# EAGLE design Brueckenverstaerker v3 (7.X) (EAGLE 7.7.0)
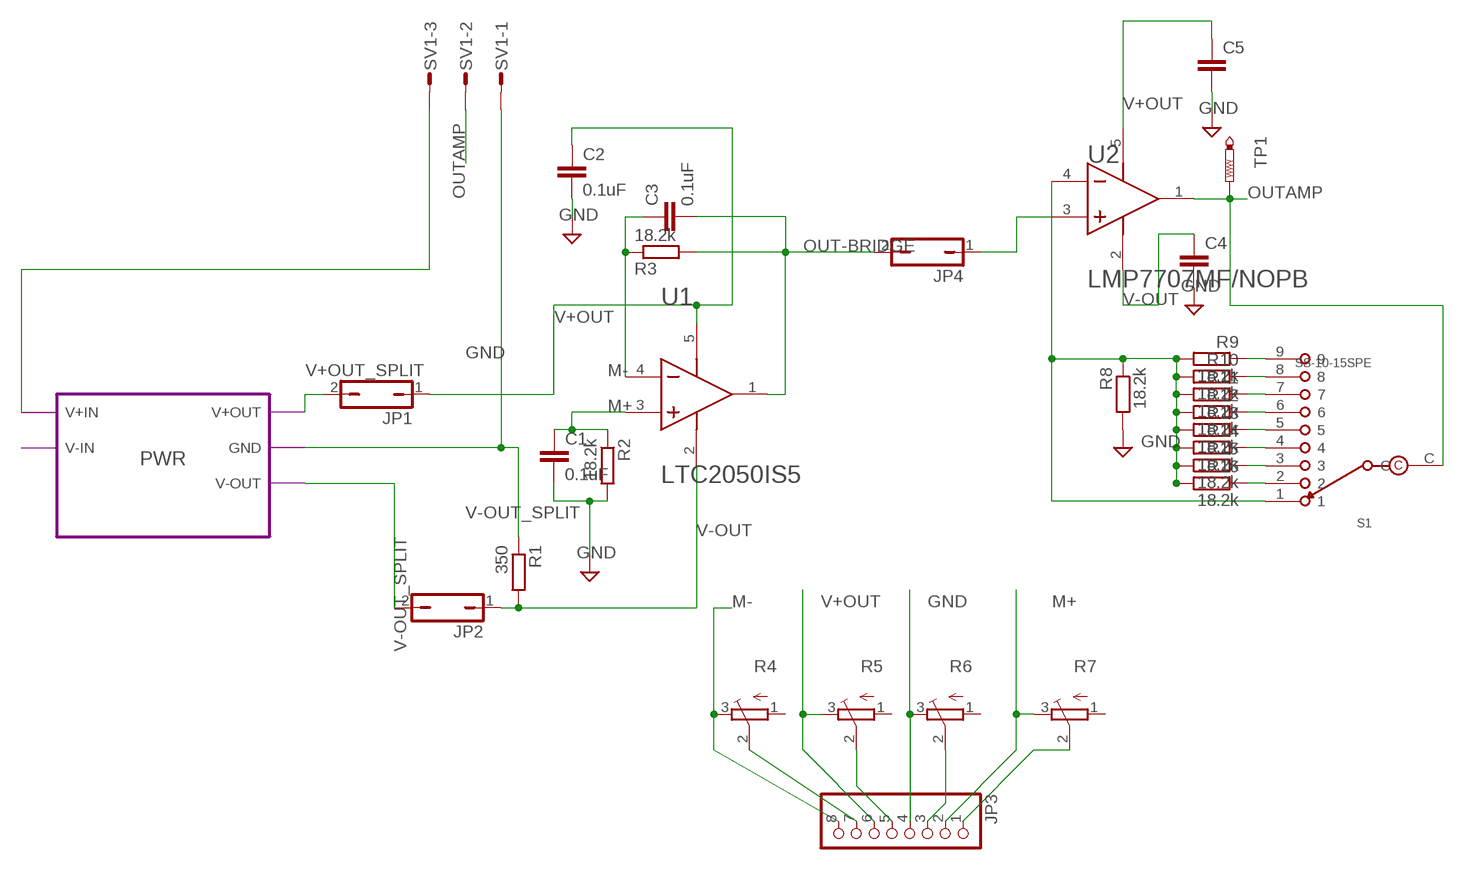
[diagram p0: schematic, sheet 1]

## Parts
C1  0.1uF  C-EUC0805  [C0805]
C2  0.1uF  C-EUC0805  [C0805]
C3  0.1uF  C-EUC0805  [C0805]
C4  C-EUC0805  [C0805]
C5  C-EUC0805  [C0805]
JP1  JP1Q  [JP1]
JP2  JP1Q  [JP1]
JP3  PINHD-1X8/90  [1X08/90]
JP4  JP1Q  [JP1]
R1  350  R-EU_R0805  [R0805]
R2  18.2k  R-EU_R0805  [R0805]
R3  18.2k  R-EU_R0805  [R0805]
R4  TRIM_EU-3223J  [3223J]
R5  TRIM_EU-3223J  [3223J]
R6  TRIM_EU-3223J  [3223J]
R7  TRIM_EU-3223J  [3223J]
R8  18.2k  R-EU_R0603  [R0603]
R9  18.2k  R-EU_R0603  [R0603]
R10  18.2k  R-EU_R0603  [R0603]
R11  18.2k  R-EU_R0603  [R0603]
R12  18.2k  R-EU_R0603  [R0603]
R13  18.2k  R-EU_R0603  [R0603]
R14  18.2k  R-EU_R0603  [R0603]
R15  18.2k  R-EU_R0603  [R0603]
R16  18.2k  R-EU_R0603  [R0603]
S1  SS-10-15SPE  [SW_SS-10-15SPE]
SV1  L03P  [L03P]
TP1  PTR1B1,27  [B1,27]
U1  LINEAR_TECHNOLOGY_LTC2050IS5LINEAR_TECHNOLOGY_LTC2050IS5_0_0  [LINEAR_TECHNOLOGY_LTC2050IS5_0]
U2  TI_NATIONAL_SEMICONDUCTOR_LMP7707MF-NOPBTI_NATIONAL_SEMICONDUCTOR_LMP7707MF-NOPB_0_1  [TI_NATIONAL_SEMICONDUCTOR_LMP7707MF-NOPB_1]

## Module instances
PWR = POWERSUPPLY

## Nets
GND: C1.2 C2.2 C4.2 C5.2 JP3.4 R1.1 R2.2 R6.3(E) R8.2 SV1.1 ; port PWR.GND
M+: C1.1 JP3.2 R2.1 R7.3(E) U1.3(+IN)
M-: C3.1 JP3.8 R3.1 R4.3(E) U1.4(-IN)
N$1: JP3.7 R4.2(S)
N$2: R9.1 S1.9
N$3: R8.1 R9.2 R10.2 R11.2 R12.2 R13.2 R14.2 R15.2 R16.2 S1.1 U2.4(IN-)
N$4: JP3.5 R5.2(S)
N$5: R10.1 S1.8
N$6: JP3.3 R6.2(S)
N$7: R11.1 S1.7
N$8: JP3.1 R7.2(S)
N$9: JP4.1 U2.3(IN+)
N$11: R12.1 S1.6
N$12: R13.1 S1.5
N$13: R14.1 S1.4
N$14: R15.1 S1.3
N$15: R16.1 S1.2
OUT-BRIDGE: C3.2 JP4.2 R3.2 U1.1(OUT)
OUTAMP: S1.C SV1.2 TP1.TP U2.1(OUT)
V+IN: SV1.3 ; port PWR.V+IN
V+OUT: C2.1 C5.1 JP1.1 JP3.6 R5.3(E) U1.5(V+) U2.5(V+)
V+OUT_SPLIT: JP1.2 ; port PWR.V+OUT
V-OUT: C4.1 JP2.1 R1.2 U1.2(V-) U2.2(V-)
V-OUT_SPLIT: JP2.2 ; port PWR.V-OUT
Unconnected: R4.1(A) R5.1(A) R6.1(A) R7.1(A)

## Library data of the parts
C1-C5 = rcl:C-EU: CAPACITOR, European symbol
JP1 JP2 JP4 = jumper:JP1Q: JUMPER
JP3 = pinhead:PINHD-1X8: PIN HEADER
R1-R3 R8-R16 = rcl:R-EU_: RESISTOR, European symbol
R4-R7 = pot:TRIM_EU-: POTENTIOMETER
S1 = SS-10-15SPE:SS-10-15SPE: Switch Rotary SP Screwdriver PC Pins 0.1A 5VDC Plastic Bag; AVAILABILITY: Unavailable; DESCRIPTION: Switch Rotary SP Screwdriver PC Pins 0.1A 5VDC Plastic Bag; MF: Nidec Copal; MP: SS-10-15SPE; PACKAGE: None; PRICE: None
SV1 = con-amp-mt:L03P: AMP MT CONNECTOR; OC_FARNELL: unknown; OC_NEWARK: unknown
TP1 = testpad:PTR1: TEST PIN
U1 = Linear Technology - LTC2050IS5:LINEAR_TECHNOLOGY_LTC2050IS5: LT-LT1395-LT18XX-LTC20XX-5; CHANNELS_: 1; CIIVA_IDS: 8827709; CODE__JEDEC: MO-193; COMPONENT_LINK_1_DESCRIPTION: Manufacturer URL; COMPONENT_LINK_1_URL: http://www.linear.com/; COMPONENT_LINK_3_DESCRIPTION: Package Specification; COMPONENT_LINK_3_URL: http://cds.linear.com/docs/en/packaging/SOT_5_05-08-1635.pdf; DATASHEET: http://cds.linear.com/docs/en/datasheet/2050fc.pdf; DATASHEET_VERSION: Rev C; FOOTPRINT_VARIANT_NAME_0: Level C; FOOTPRINT_VARIANT_NAME_1: Level B; FOOTPRINT_VARIANT_NAME_2: Level A; GBW_MHZ_TYPICAL: 3; IMPORTED: yes; IMPORTED_FROM: vault; IMPORT_TS: 1521848410; IS_MA_TYPICAL: 0.8; LINEAR_TECHNOLOGY_PART_NUMBER: LTC2050; MF: Linear Technology; MOUNTING_TECHNOLOGY: Surface Mount; MPN: LTC2050IS5; PACKAGE: LT-S5-5-TSOT-23; PACKAGE_DESCRIPTION: 5-Lead Plastic TSOT-23, Body 1.63 x 2.90 mm, Pitch 0.95 mm; PREFIX: U; RELEASE_DATE: 1378745203; SR_VUS_TYPICAL: 2; TYPE: ZD; VAULT_GUID: 8555B049-ED4F-4380-B7FA-2379FF4543B7; VAULT_REVISION: DA8BFDE5-EBAF-4C16-8E03-9404D310B1D4; VOS_MV_TYPICAL: 0.0005; VS_MAX_V: 6; VS_MIN_V: 2.7
U2 = NOPB:TI_NATIONAL_SEMICONDUCTOR_LMP7707MF-NOPB: AMP-OPA-LM7121-5; CIIVA_IDS: 1322878; COMPONENT_LINK_1_DESCRIPTION: Datasheet URL; COMPONENT_LINK_1_URL: http://www.ti.com/general/docs/lit/getliterature.tsp?genericPartNumber=LMP7707&fileType=pdf; COMP_TYPE: Amplifiers; FOOTPRINT_VARIANT_NAME_0: Level C; FOOTPRINT_VARIANT_NAME_1: Level B; FOOTPRINT_VARIANT_NAME_2: Level A; IMPORTED: yes; IMPORTED_FROM: vault; IMPORT_TS: 1521865583; MF: TI National Semiconductor; MPN: LMP7707MF/NOPB; PACKAGE_DESCRIPTION: Molded SOT-23, .115 x .063 x .040 in Body, 5 Lead, .0375 in Pitch; PACKAGE_REFERENCE: DBV0005A; PACKAGE_TOP_MARKING: AH4A*XTT; PIN_COUNT: 5; POWER_WISE: Y; PREFIX: U; RELEASE_DATE: 1464069256; ROHS: Yes; VAULT_GUID: D2A2C10E-6A8E-42CA-BB51-102401FD650E; VAULT_REVISION: 935156D0-10AB-4BAD-9D3C-6DAEB643FFBC

## Module POWERSUPPLY
Ports: V+OUT(io) GND(io) V-OUT(io) V+IN(io) V-IN(io)
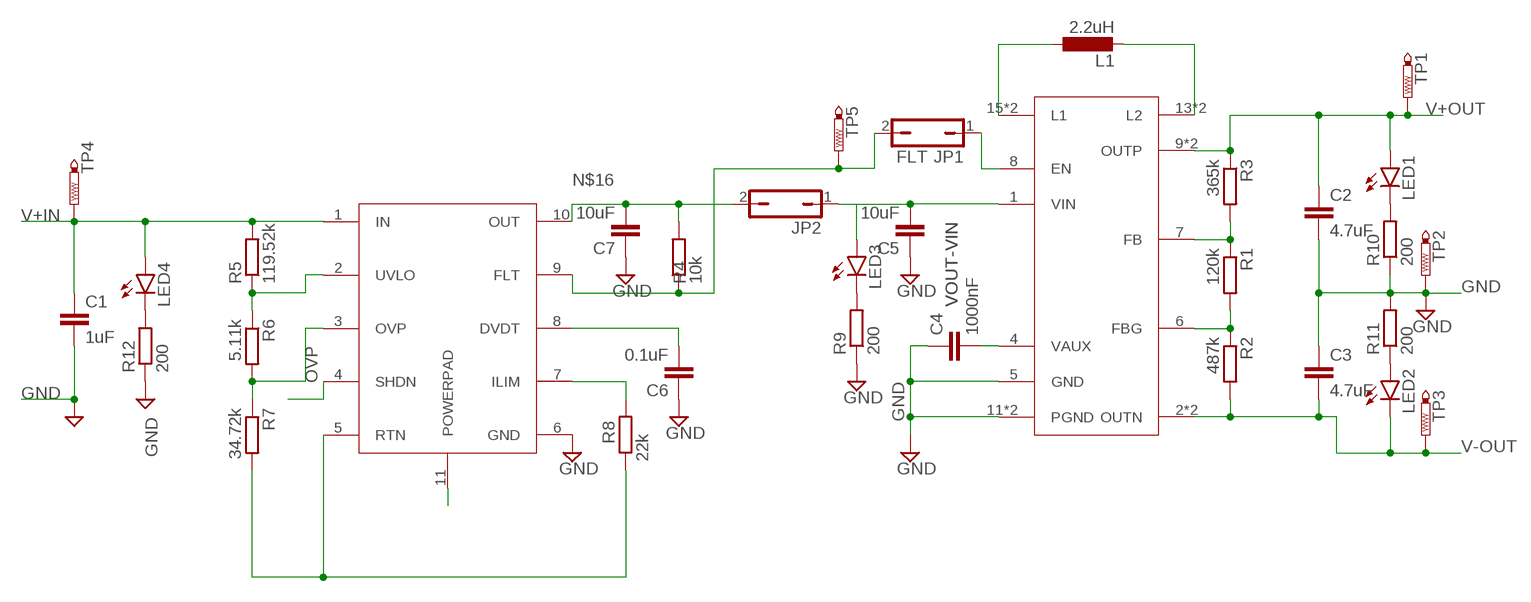
[diagram p1: schematic, module POWERSUPPLY, sheet 1]

### Parts
C1  1uF  C-EUC0805K  [C0805K]
C2  4.7uF  C-EUC0805K  [C0805K]
C3  4.7uF  C-EUC0805K  [C0805K]
C4  1000nF  C-EUC0805K  [C0805K]
C5  10uF  C-EUC0805K  [C0805K]
C6  0.1uF  C-EUC0805K  [C0805K]
C7  10uF  C-EUC0805K  [C0805K]
JP1  JP1Q  [JP1]
JP2  JP1Q  [JP1]
L1  2.2uH  L-EUL2825P  [L2825P]
LED1  LED3MM  [LED3MM]
LED2  LED3MM  [LED3MM]
LED3  LED3MM  [LED3MM]
LED4  LED3MM  [LED3MM]
PROTECT-IC  TPS26620DRCRTPS26620DR  [SON50P300X300X100-11N]
R1  120k  R-EU_R0805  [R0805]
R2  487k  R-EU_R0805  [R0805]
R3  365k  R-EU_R0805  [R0805]
R4  10k  R-EU_R0805  [R0805]
R5  119.52k  R-EU_R0805  [R0805]
R6  5.11k  R-EU_R0805  [R0805]
R7  34.72k  R-EU_R0805  [R0805]
R8  22k  R-EU_R0805  [R0805]
R9  200  R-EU_R0805  [R0805]
R10  200  R-EU_R0805  [R0805]
R11  200  R-EU_R0805  [R0805]
R12  200  R-EU_R0805  [R0805]
SPLIT  TPS65135TPS65135  [QFN50P300X300X80-17N]
TP1  PTR1B1,27  [B1,27]
TP2  PTR1B1,27  [B1,27]
TP3  PTR1B1,27  [B1,27]
TP4  PTR1B1,27  [B1,27]
TP5  PTR1B1,27  [B1,27]

### Nets
FLT: JP1.2 PROTECT-IC.9(FLT) R4.1 TP5.TP
GND: C1.2 C2.2 C3.1 C4.1 C5.1 C6.1 C7.1 PROTECT-IC.6(GND) R9.1 R10.1 R11.2 R12.1 SPLIT.5(GND) SPLIT.11(PGND) SPLIT.12(PGND) TP2.TP
N$1: PROTECT-IC.2(UVLO) R5.1 R6.1
N$2: L1.1 SPLIT.15(L1) SPLIT.16(L1)
N$3: L1.2 SPLIT.13(L2) SPLIT.14(L2)
N$4: C6.2 PROTECT-IC.8(DVDT)
N$5: R1.1 R3.2 SPLIT.7(FB)
N$6: R1.2 R2.1 SPLIT.6(FBG)
N$7: PROTECT-IC.5(RTN) R7.2 R8.1
N$8: C4.2 SPLIT.4(VAUX)
N$9: PROTECT-IC.7(ILIM) R8.2
N$10: LED3.K(C) R9.2
N$11: LED1.K(C) R10.2
N$12: PROTECT-IC.11(POWERPAD)
N$13: LED2.A R11.1
N$14: PROTECT-IC.4(SHDN)
N$15: JP1.1 SPLIT.8(EN)
N$16: C7.2 JP2.2 PROTECT-IC.10(OUT) R4.2
N$17: LED4.K(C) R12.2
OVP: PROTECT-IC.3(OVP) R6.2 R7.1
V+IN: C1.1 LED4.A PROTECT-IC.1(IN) R5.2 TP4.TP
V+OUT: C2.1 LED1.A R3.1 SPLIT.9(OUTP) SPLIT.10(OUTP) TP1.TP
V-OUT: C3.2 LED2.K(C) R2.2 SPLIT.2(OUTN) SPLIT.3(OUTN) TP3.TP
VOUT-VIN: C5.2 JP2.1 LED3.A SPLIT.1(VIN)

### Library data of the parts
C1-C7 = rcl@1:C-EU: CAPACITOR, European symbol; SPICEPREFIX: C
JP1 JP2 = jumper:JP1Q: JUMPER
L1 = rcl@1:L-EU: INDUCTOR, European symbol; SPICEPREFIX: L
LED1-LED4 = led:LED: LED OSRAM: - CHIPLED LG R971, LG N971, LY N971, LG Q971, LY Q971, LO R971, LY R971 LH N974, LH R974 LS Q976, LO Q976, LY Q976 LO Q996 - Hyper CHIPLED LW Q18S LB Q993, LB Q99A, LB R99A - SideLED LS A670, LO A670, LY A670, LG A670, LP A670 LB A673, LV A673, LT A673, LW A673 LH A674 LY A675 LS A676, LA A676, LO A676, LY A676, LW A676 LS A679, LY A679, LG A679 - Hyper Micro SIDELED® LS Y876, LA Y876, LO Y876, LY Y876 LT Y87S - SmartLED LW L88C, LW L88S LB L89C, LB L89S, LG L890 LS L89K, LO L89K, LY L89K LS L896, LA L896, LO L896, LY L896 - TOPLED LS T670, LO T670, LY T670, LG T670, LP T670 LSG T670, LSP T670, LSY T670, LOP T670, LYG T670 LG T671, LOG T671, LSG T671 LB T673, LV T673, LT T673, LW T673 LH T674 LS T676, LA T676, LO T676, LY T676, LB T676, LH T676, LSB T676, LW T676 LB T67C, LV T67C, LT T67C, LS T67K, LO T67K, LY T67K, LW E67C LS E67B, LA E67B, LO E67B, LY E67B, LB E67C, LV E67C, LT E67C LW T67C LS T679, LY T679, LG T679 LS T770, LO T770, LY T770, LG T770, LP T770 LB T773, LV T773, LT T773, LW T773 LH T774 LS E675, LA E675, LY E675, LS T675 LS T776, LA T776, LO T776, LY T776, LB T776 LHGB T686 LT T68C, LB T68C - Hyper Mini TOPLED® LB M676 - Mini TOPLED Santana® LG M470 LS M47K, LO M47K, LY M47K Source: http://www.osram.convergy.de LUXEON: - LUMILED® LXK2-PW12-R00, LXK2-PW12-S00, LXK2-PW14-U00, LXK2-PW14-V00 LXK2-PM12-R00, LXK2-PM12-S00, LXK2-PM14-U00 LXK2-PE12-Q00, LXK2-PE12-R00, LXK2-PE12-S00, LXK2-PE14-T00, LXK2-PE14-U00 LXK2-PB12-K00, LXK2-PB12-L00, LXK2-PB12-M00, LXK2-PB14-N00, LXK2-PB14-P00, LXK2-PB14-Q00 LXK2-PR12-L00, LXK2-PR12-M00, LXK2-PR14-Q00, LXK2-PR14-R00 LXK2-PD12-Q00, LXK2-PD12-R00, LXK2-PD12-S00 LXK2-PH12-R00, LXK2-PH12-S00 LXK2-PL12-P00, LXK2-PL12-Q00, LXK2-PL12-R00 Source: www.luxeon.com KINGBRIGHT: KA-3528ASYC Source: www.kingbright.com
PROTECT-IC = SON50P300X300X100-11N:TPS26620DRCR: TPS26620DR
R1-R12 = rcl:R-EU_: RESISTOR, European symbol
SPLIT = QFN50P300X300X80-17N:TPS65135: TPS65135
TP1-TP5 = testpad:PTR1: TEST PIN

## Net classes
0 default: width 0.254 mm, clearance 0.205 mm

## Board
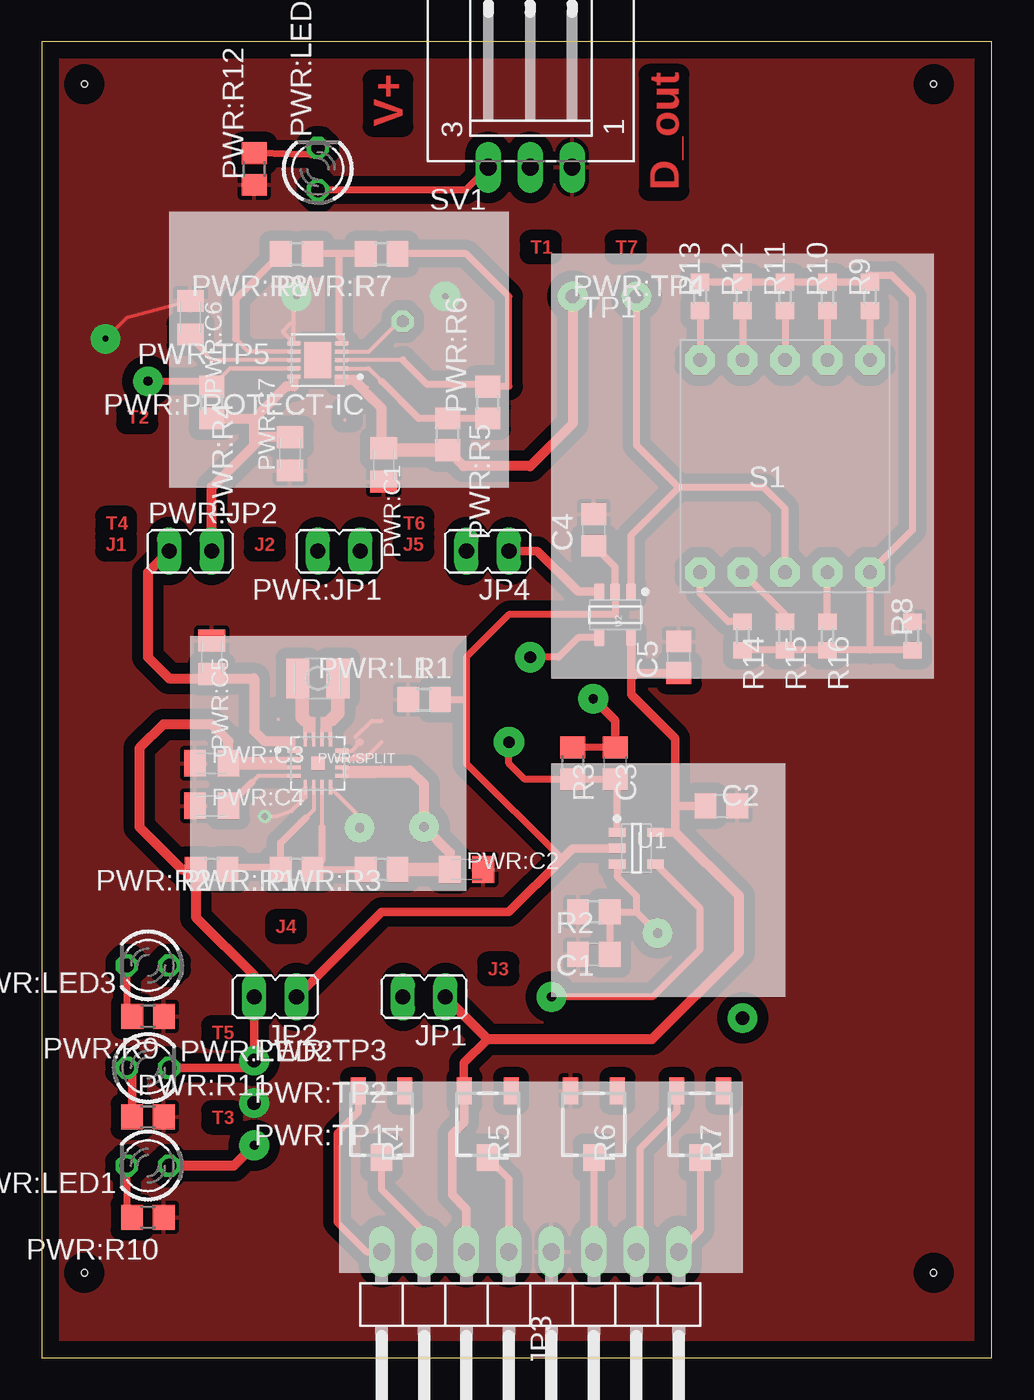
[diagram p2: board, top side]
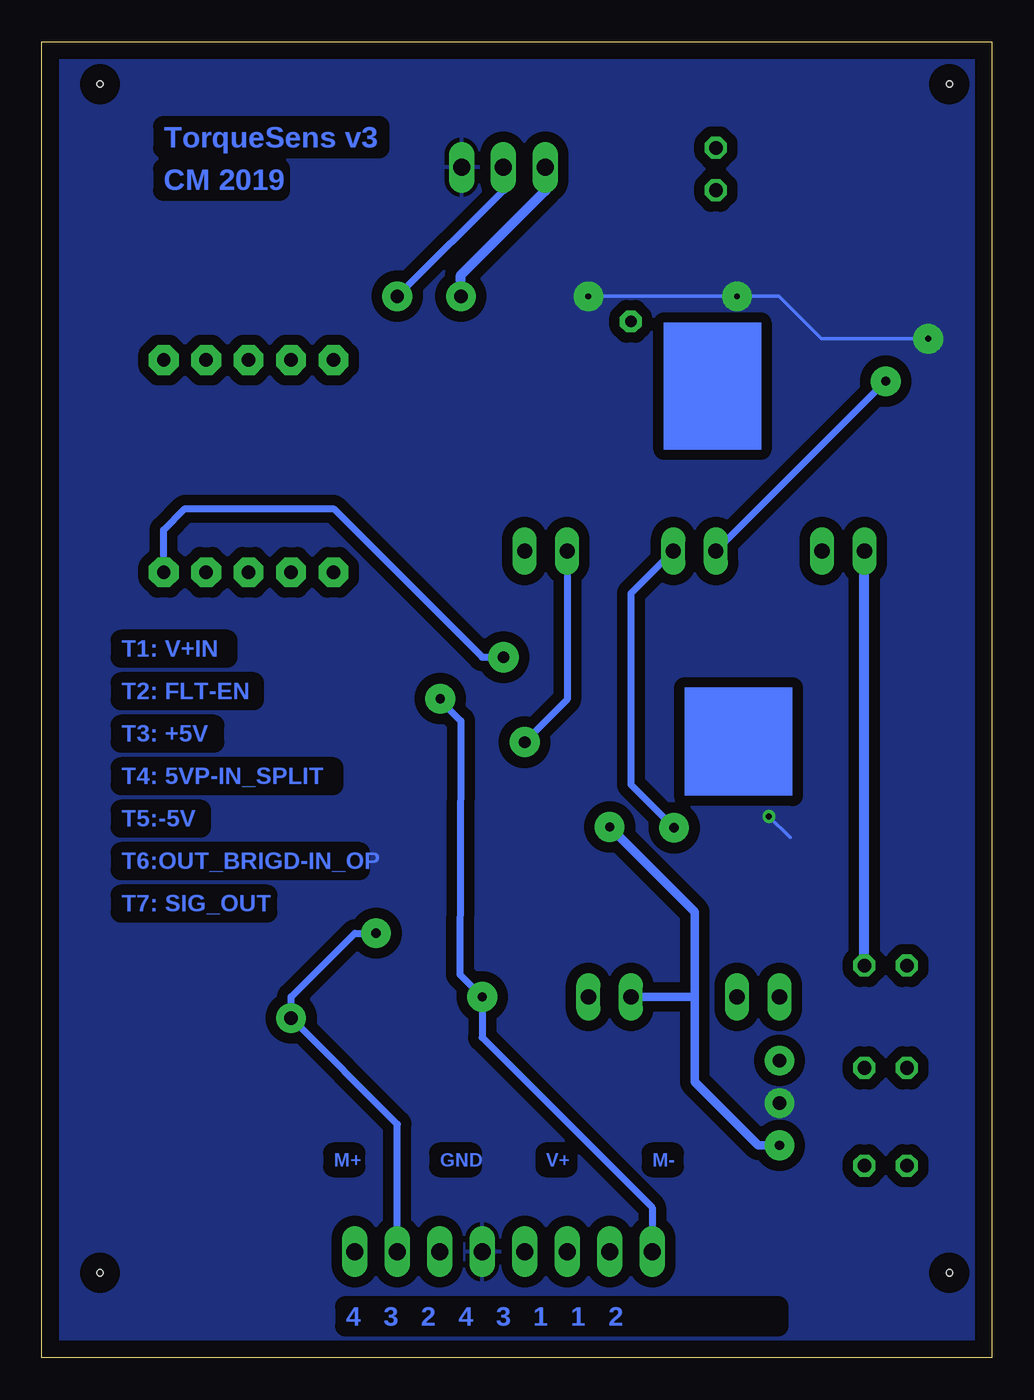
[diagram p3: board, bottom side, seen from below]

Size 56.82 x 78.73 mm. Coordinates in mm from the lower left corner, seen from the top.
Outline: 0,0 56.82,0 56.82,78.73 0,78.73 0,0
Copper layers (1*16): Top 0.035mm / dielectric 1.5mm / Bottom 0.035mm
Design rules "default *": minimum track width 8mil, minimum drill 0.35mm, track to track 25mil, track to pad 25mil, pad to pad 8mil, via to via 20mil, smd to smd 8mil, copper to edge 40mil, drill to drill 40mil, minimum pad ring 10mil, minimum via ring 8mil, stop-mask expansion 4mil, vias tented up to drill 0mil, thermal gap 10mil
Holes 0.35 mm at 2.54,76.2 53.34,76.2 53.34,5.08 2.54,5.08

### Footprints (pad centres in the part's own frame; a part is rotated, then mirrored left to right if it is on the bottom)
C0805 = smd 1.3 x 1.5: 1 -0.95,0; 2 0.95,0
JP1 = drill 0.914 long: 1 0,-1.27; 2 0,1.27
1X08/90 = drill 1.016 long: 1 -8.89,-3.81; 2 -6.35,-3.81; 3 -3.81,-3.81; 4 -1.27,-3.81; 5 1.27,-3.81; 6 3.81,-3.81; 7 6.35,-3.81; 8 8.89,-3.81
C0805K = smd 1.3 x 1.6: 1 -1,0; 2 1,0
L2825P = smd 1.4 x 2.4: 1 -1.2,0; 2 1.2,0
LED3MM = drill 0.813 octagon: A -1.27,0; K 1.27,0
SON50P300X300X100-11N = smd 0.86 x 0.26: 1 -1.435,1; 2 -1.435,0.5; 3 -1.435,0; 4 -1.435,-0.5; 5 -1.435,-1; 6 1.435,-1; 7 1.435,-0.5; 8 1.435,0; 9 1.435,0.5; 10 1.435,1 | smd 1.6 x 2.15: 11 0,0
R0805 = smd 1.3 x 1.5: 1 -0.95,0; 2 0.95,0
QFN50P300X300X80-17N = smd 0.88 x 0.26: 1 -1.435,0.75; 2 -1.435,0.25; 3 -1.435,-0.25; 4 -1.435,-0.75; 9 1.435,-0.75; 10 1.435,-0.25; 11 1.435,0.25; 12 1.435,0.75 | smd 0.26 x 0.88: 5 -0.75,-1.435; 6 -0.25,-1.435; 7 0.25,-1.435; 8 0.75,-1.435; 13 0.75,1.435; 14 0.25,1.435; 15 -0.25,1.435; 16 -0.75,1.435 | smd 0.8 x 0.8: 17 0,0
B1,27 = smd 1.27 x 1.27: TP 0,0
3223J = smd 1.6 x 0.9: 1 -2,1.4; 3 -2,-1.4 | smd 1.6 x 1.3: 2 2,0
R0603 = smd 1 x 1.1: 1 -0.85,0; 2 0.85,0
SW_SS-10-15SPE = drill 0.8 pad 1.778 octagon: 1 -5.08,6.35; 2 -2.54,6.35; 3 2.54,6.35; 4 5.08,6.35; 5 5.08,-6.35; 6 2.54,-6.35; 7 0,-6.35; 8 -2.54,-6.35; 9 -5.08,-6.35; C 0,6.35
L03P = drill 1.016 long: 1 2.5,-6.25; 2 0,-6.25; 3 -2.5,-6.25
LINEAR_TECHNOLOGY_LTC2050IS5_0 = smd 1 x 0.55: 1 -1.15,0.95; 2 -1.15,0; 3 -1.15,-0.95; 4 1.15,-0.95; 5 1.15,0.95
TI_NATIONAL_SEMICONDUCTOR_LMP7707MF-NOPB_1 = smd 1 x 0.6: 1 -1.375,0.95; 2 -1.375,0; 3 -1.375,-0.95; 4 1.375,-0.95; 5 1.375,0.95

### Placement (x,y rotation side)
C1  33.02,24.13 180 top
C2  40.64,33.02 0 top
C3  34.29,35.56 270 top
C4  33.02,49.53 90 top
C5  38.1,41.91 90 top
JP1  22.86,21.59 90 top
JP2  13.97,21.59 90 top
JP3  29.21,2.54 180 top
JP4  26.67,48.26 90 top
PWR:C1  1uF  [C0805K]  20.45,53.42 270 top
PWR:C2  4.7uF  [C0805K]  25.4,29.21 0 top
PWR:C3  4.7uF  [C0805K]  10.16,35.56 0 top
PWR:C4  1000nF  [C0805K]  10.16,33.02 0 top
PWR:C5  10uF  [C0805K]  10.16,41.91 270 top
PWR:C6  0.1uF  [C0805K]  8.89,62.23 270 top
PWR:C7  10uF  [C0805K]  14.84,54.09 90 top
PWR:JP1  [JP1]  17.78,48.26 90 top
PWR:JP2  [JP1]  8.89,48.26 270 top
PWR:L1  2.2uH  [L2825P]  16.51,40.64 0 top
PWR:LED1  [LED3MM]  6.35,11.49 180 top
PWR:LED2  [LED3MM]  6.35,17.34 0 top
PWR:LED3  [LED3MM]  6.36,23.46 180 top
PWR:LED4  [LED3MM]  16.51,71.12 90 top
PWR:PROTECT-IC  [SON50P300X300X100-11N]  16.51,59.69 180 top
PWR:R1  120k  [R0805]  15.24,29.21 180 top
PWR:R2  487k  [R0805]  10.16,29.21 180 top
PWR:R3  365k  [R0805]  20.32,29.21 180 top
PWR:R4  10k  [R0805]  10.16,57.15 270 top
PWR:R5  119.52k  [R0805]  24.27,55.25 270 top
PWR:R6  5.11k  [R0805]  26.67,57.15 90 top
PWR:R7  34.72k  [R0805]  20.32,66.04 180 top
PWR:R8  22k  [R0805]  15.24,66.04 180 top
PWR:R9  200  [R0805]  6.36,20.43 180 top
PWR:R10  200  [R0805]  6.35,8.4 180 top
PWR:R11  200  [R0805]  6.35,14.42 0 top
PWR:R12  200  [R0805]  12.7,71.12 90 top
PWR:SPLIT  TPS65135TPS65135  [QFN50P300X300X80-17N]  16.51,35.56 0 top
PWR:TP1  PTR1B1,27  [B1,27]  12.7,12.7 0 top
PWR:TP2  PTR1B1,27  [B1,27]  12.7,15.24 0 top
PWR:TP3  PTR1B1,27  [B1,27]  12.7,17.78 0 top
PWR:TP4  PTR1B1,27  [B1,27]  31.75,63.5 0 top
PWR:TP5  PTR1B1,27  [B1,27]  6.35,58.42 0 top
R1  22.86,39.37 0 top
R2  33.02,26.67 180 top
R3  31.75,35.56 270 top
R4  20.32,13.97 270 top
R5  26.67,13.97 270 top
R6  33.02,13.97 270 top
R7  39.37,13.97 270 top
R8  52.07,43.18 90 top
R9  49.53,63.5 90 top
R10  46.99,63.5 90 top
R11  44.45,63.5 90 top
R12  41.91,63.5 90 top
R13  39.37,63.5 90 top
R14  41.91,43.18 270 top
R15  44.45,43.18 270 top
R16  46.99,43.18 270 top
S1  44.45,53.34 180 top
SV1  29.21,77.47 0 top
TP1  35.56,63.5 180 top
U1  35.56,30.48 0 top
U2  34.29,44.45 270 top

### Tracks (layer width: path | path; a pad name or v marks a point on that pad's centre or on a via)
GND  (via drill 0.35, 0.35 pad 1.78, 0.8 pad 1.78)
  Top 0.203: 14.92,32.7 14.02,32.38 v13.34,32.38 | PWR:C6.1 5.08,62.23 v3.81,60.96 | v15.24,63.5 15.07,63.34
  Top 0.254: 15.07,61.9 15.07,63.34 | PWR:SPLIT.12 18.53,36.31 19.05,36.83 | 18.76,37.12 19.73,38.1 20.32,38.1 | PWR:SPLIT.11 18.52,35.81 19.3,35.81 19.5,36.01 20.32,36.83 | 15.51,33.29 15.76,33.54 PWR:SPLIT.5 15.51,33.87 15.51,33.29 | 15.51,33.29 14.92,32.7 | 15.07,61.9 14.9,61.9 14.43,61.43 14.43,61.34 PWR:PROTECT-IC.6 15.07,61.9
  Top 0.305: 18.52,35.81 18.72,36.01 19.5,36.01
  Top 0.406: 19.05,36.83 18.96,36.83
  Bottom 0.203: v13.34,32.38 12.06,31.11 | v24.13,63.5 v15.24,63.5 12.75,63.5 10.21,60.96 v3.81,60.96
  other vias: 12.7,15.24
  pour Bottom: 0,78.74 55.88,78.74 55.88,0 0,0
  pour Top: 0,78.74 55.88,78.74 55.88,0 0,0
M+  (via drill 0.55 pad 1.78, 0.8 pad 1.78)
  Top 0.406: R7.3 37.97,14.7 35.76,12.5 35.76,6.55 JP3.2 | C1.1 R2.1 35.56,26.67 | v41.91,20.32 42.23,20.32 | 35.56,26.67 35.56,27.62 34.41,28.77 U1.3 | 35.56,26.67 v36.83,25.4
  Bottom 0.406: v36.83,25.4 38.1,25.4 41.91,21.59 v41.91,20.32 35.56,13.97 JP3.2
M-  (via drill 0.55 pad 1.78)
  Top 0.406: 18.85,16.04 R4.3 18.92,14.7 17.65,13.43 17.65,8.11 19.41,6.35 JP3.8 | v30.48,21.59 36.53,21.59 39.37,24.43 39.37,26.87 U1.4 | C3.1 R3.1
  Top 0.508: 33.04,39.37 v32.98,39.43 34.29,38.12 C3.1
  Bottom 0.406: JP3.8 20.32,8.99 30.48,19.15 v30.48,21.59 31.81,22.92 31.75,36.83 31.75,38.1 32.98,39.33 v32.98,39.43
N$1
  Top 0.406: JP3.7 22.76,6.45 22.76,7.62 20.32,10.06 R4.2
N$2
  Top 0.406: R9.1 S1.9
N$3  (via drill 0.7 pad 1.8)
  Top 0.406: R14.2 R15.2 R16.2 49.53,42.33 | R13.2 R12.2 R11.2 R10.2 R9.2 49.53,64.77 50.8,64.77 52.07,63.5 52.07,49.53 S1.1 49.53,42.33 | R8.1 49.53,42.33 | U2.4 32.07,43.08 30.91,41.91 v29.21,41.91
  Bottom 0.406: S1.1 49.53,49.53 48.26,50.8 39.37,50.8 30.48,41.91 v29.21,41.91
N$4
  Top 0.406: R5.2 27.94,10.7 JP3.5
N$5
  Top 0.406: R10.1 S1.8
N$6
  Top 0.406: R6.2 JP3.3
N$7
  Top 0.406: R11.1 S1.7
N$8
  Top 0.406: R7.2 39.37,7.62 JP3.1
N$9
  Top 0.508: U2.3 32.07,45.83 29.64,48.26 JP4.1
N$10
  Top 0.406: 19.36,57.69 18.64,58.41 18.32,58.41 18.3,58.43
N$11
  Top 0.406: R12.1 S1.6
N$12
  Top 0.406: R13.1 S1.5
N$13
  Top 0.406: R14.1 41.06,44.03 39.37,45.72 S1.4
N$14
  Top 0.406: S1.3 44.45,44.45 R15.1
N$15
  Top 0.406: R16.1 S1.2
OUT-BRIDGE  (via drill 0.7 pad 1.8)
  Top 0.406: v27.94,36.83 27.94,35.56 28.89,34.61 R3.2 C3.2 34.41,34.49 U1.1
  Bottom 0.406: JP4.2 25.4,39.37 v27.94,36.83
OUTAMP  (via drill 0.8 pad 1.78)
  Top 0.406: S1.C 44.45,50.8 43.18,52.07 38.1,52.07 | 38.1,52.07 35.56,54.61 TP1.TP | 38.1,52.07 35.24,49.21 U2.1
  Bottom 0.406: 29.17,69.89 TP1.TP
  Bottom 0.508: SV1.2 29.21,69.93 29.17,69.89
  other vias: 35.56,63.5
PWR:FLT  (via drill 0.55 pad 1.78)
  Top 0.254: PWR:PROTECT-IC.9 11.25,59.19 PWR:R4.1
  Top 0.406: PWR:TP5.TP 9.84,58.42 PWR:R4.1
  Bottom 0.406: PWR:JP1.2 PWR:TP5.TP
  other vias: 6.35,58.42
PWR:N$1
  Top 0.203: 26.51,56.04 PWR:R6.1
  Top 0.254: PWR:PROTECT-IC.2 19.55,59.19 20.32,58.42
  Top 0.406: 26.51,56.04 26.35,56.2 PWR:R5.1 22.54,56.2 20.32,58.42
PWR:N$2
  Top 0.254: PWR:SPLIT.16 15.76,38.1 | PWR:SPLIT.15 16.26,37.6 15.92,37.94
  Top 0.508: 15.5,38.36 15.68,38.18 15.76,38.1 15.92,37.94
  Top 0.813: PWR:L1.1 15.57,40.38 15.57,38.29 15.68,38.18
PWR:N$3
  Top 0.254: PWR:SPLIT.13 17.26,38.1 | PWR:SPLIT.14 16.76,37.6 16.99,37.83
  Top 0.508: 17.34,38.18 17.26,38.1 16.99,37.83
  Top 0.813: PWR:L1.2 17.71,38.55 17.52,38.36 17.34,38.18
PWR:N$4
  Top 0.203: 8.89,60.96 PWR:C6.2
  Top 0.254: PWR:PROTECT-IC.8 10.16,59.69 8.89,60.96
PWR:N$5
  Top 0.254: 16.76,31.75 PWR:SPLIT.7
  Top 0.406: PWR:R3.2 PWR:R1.1 16.76,29.78 16.76,31.75
PWR:N$6
  Top 0.203: 11.35,29.35 PWR:R2.1
  Top 0.254: PWR:SPLIT.6 16.26,32.77 15.88,32.38 15.52,32.03
  Top 0.406: 11.35,29.35 14.15,29.35 PWR:R1.2 14.29,30.8 15.52,32.03 15.79,32.3 15.79,32.31
PWR:N$7
  Top 0.203: 16.51,66.04 PWR:R8.1
  Top 0.254: PWR:PROTECT-IC.5 17.95,60.96
  Top 0.406: PWR:R7.2 17.78,66.04 | 17.78,66.04 16.51,66.04 | 17.95,60.96 17.78,61.12 17.78,66.04
PWR:N$8
  Top 0.254: PWR:SPLIT.4 12.95,34.81 12.56,34.43
  Top 0.406: PWR:C4.2 12.56,34.43
PWR:N$9
  Top 0.254: PWR:PROTECT-IC.7 12.36,60.19 11.59,60.96
  Top 0.406: PWR:R8.2 11.59,63.34 11.59,60.96
PWR:N$10
  Top 0.406: PWR:LED3.K 5.09,20.85 PWR:R9.2
PWR:N$11
  Top 0.406: PWR:LED1.K 5.08,8.82 PWR:R10.2
PWR:N$13
  Top 0.508: PWR:LED2.A 5.4,17.02 PWR:R11.1
PWR:N$14  (via drill 0.7 pad 1.3)
  Top 0.254: PWR:PROTECT-IC.4 19.55,60.19 21.59,62.23 v21.59,62
  Bottom 0.254: v21.59,62 21.59,62.23
PWR:N$15  (via drill 0.55 pad 1.78)
  Top 0.254: PWR:SPLIT.8 19.05,32.34 19.05,31.75 v19.01,31.71
  Bottom 0.406: v19.01,31.71 21.59,34.29 21.59,45.72 PWR:JP1.1
PWR:N$16
  Top 0.254: 15.07,58.45 PWR:PROTECT-IC.10 15.02,58.64 15.02,58.4
  Top 0.406: 12.7,56.2 12.82,56.2 15.02,58.4
  Top 0.61: PWR:R4.2 12.7,56.2 | 12.7,56.2 14.62,58.12 15.07,58.12 | PWR:JP2.2 10.16,52.07 12.7,54.61 | 12.7,54.61 12.7,56.2 | PWR:C7.2 13.18,55.09 12.7,54.61
PWR:N$17
  Top 0.406: PWR:LED4.K 16.09,71.97 PWR:R12.2
PWR:OVP
  Top 0.254: PWR:PROTECT-IC.3 20.32,59.69 21.59,59.69
  Top 0.406: 21.59,59.69 23.02,58.26 26.51,58.26 PWR:R6.2 27.94,58.1 27.94,63.5 25.4,66.04 PWR:R7.1
PWR:VOUT-VIN
  Top 0.254: PWR:SPLIT.1 15.07,36.5 14.69,36.88
  Top 0.61: 14.69,36.88 13.32,36.88 12.7,37.5 12.7,40.64 10.43,40.64 | PWR:C5.2 10.43,40.64 | PWR:JP2.1 6.35,46.99 6.35,41.91 7.62,40.64 10.43,40.64
  Bottom 0.61: PWR:JP2.1 PWR:LED3.A
S$1
  Top 0.61: 18.3,58.52 18.04,58.52
V+IN  (via drill 0.8 pad 1.78)
  Top 0.254: PWR:PROTECT-IC.1 18.78,58.69 19.45,58.02 19.45,57.68
  Top 0.406: 20.57,54.3 PWR:C1.1 20.38,54.49 | SV1.3 25.34,69.85 PWR:LED4.A
  Top 0.61: PWR:TP4.TP 31.75,55.88 29.21,53.34 25.23,53.34 PWR:R5.2 | 20.32,54.55 20.32,56.8 19.45,57.68
  Top 0.813: PWR:R5.2 20.57,54.3 | PWR:C1.1 20.32,54.55
  Bottom 0.61: PWR:TP4.TP 31.75,64.77 26.71,69.81 SV1.3
  other vias: 31.75,63.5
V+OUT
  Top 0.508: JP3.6 25.4,8.89 24.54,9.75 24.54,13.36 25.27,14.09 R5.3 25.25,15.99 25.25,17.63 26.67,19.05 | U1.5 37.89,31.43 37.89,33.02 | 39.48,33.02 C2.1 37.89,33.02 | 37.89,33.02 37.89,37.04 35.24,39.69 35.24,40.64 | 35.24,40.64 U2.5 | C5.1 35.56,40.96 35.24,40.64
  Top 0.61: JP1.1 26.67,19.05 36.48,19.05 41.7,24.26 41.7,27.62 37.89,31.43
  Bottom 0.406: 25.4,5.08 JP3.6
V+OUT_SPLIT  (via drill 0.55 pad 1.78)
  Top 0.254: 18.28,35.15 PWR:SPLIT.9 19.98,34.81 20.32,35.15 20.16,35.31 PWR:SPLIT.10 18.11,35.15
  Top 0.61: PWR:C2.1 24.4,30.21 v22.86,31.75 22.86,34.29 22,35.15 20.32,35.15 | PWR:TP1.TP 11.49,11.49 PWR:LED1.A
  Top 0.813: PWR:C2.1 PWR:R3.1
  Bottom 0.508: PWR:TP1.TP 13.97,12.7 17.78,16.51 17.78,21.59 | v22.86,31.75 17.78,26.67 17.78,21.59 | JP1.2 17.78,21.59
  other vias: 12.7,12.7
V-OUT
  Top 0.406: 31.11,29.84 25.4,35.56 25.4,39.37 | 25.4,39.37 25.4,41.91 27.94,44.45 34.29,44.45 U2.2 34.29,47.31 C4.1 | R1.2 25.4,39.37
  Top 0.508: U1.2 31.75,30.48 31.11,29.84 27.94,26.67 20.32,26.67 JP2.1
V-OUT_SPLIT  (via drill 0.8 pad 1.78)
  Top 0.254: 11.41,35.31 PWR:SPLIT.3 | PWR:SPLIT.2 11.41,35.81 PWR:C3.2
  Top 0.406: 11.41,35.31 PWR:C3.2 12.59,35.56
  Top 0.508: PWR:TP3.TP JP2.2 | 12.26,17.34 PWR:LED2.K
  Top 0.61: PWR:C3.2 11.16,36.9 10.16,37.9 7.26,37.9 5.84,36.47 5.84,31.75 8.38,29.21 PWR:R2.2 9.21,26.35 12.7,22.86 JP2.2 | PWR:TP3.TP 12.26,17.34
  other vias: 12.7,17.78
(copper drawn outside any net)
  shapes: Bottom area x3, Top area x7

### Text on the board
Top: V+ | D_out | T1 | T7 | T2 | . | T4 | T6 | J1 | J2 | J5 | . | J4 | J3 | T5 | T3
Bottom: TorqueSens v3 | CM 2019 | T1: V+IN | T2: FLT-EN | T3: +5V | T4: 5VP-IN_SPLIT | T5:-5V | T6:OUT_BRIGD-IN_OP | T7: SIG_OUT | M- | V+ | GND | M+ | 4 3 2 4 3 1 1 2